# EAGLE design midiwall (EAGLE 6.6.0)
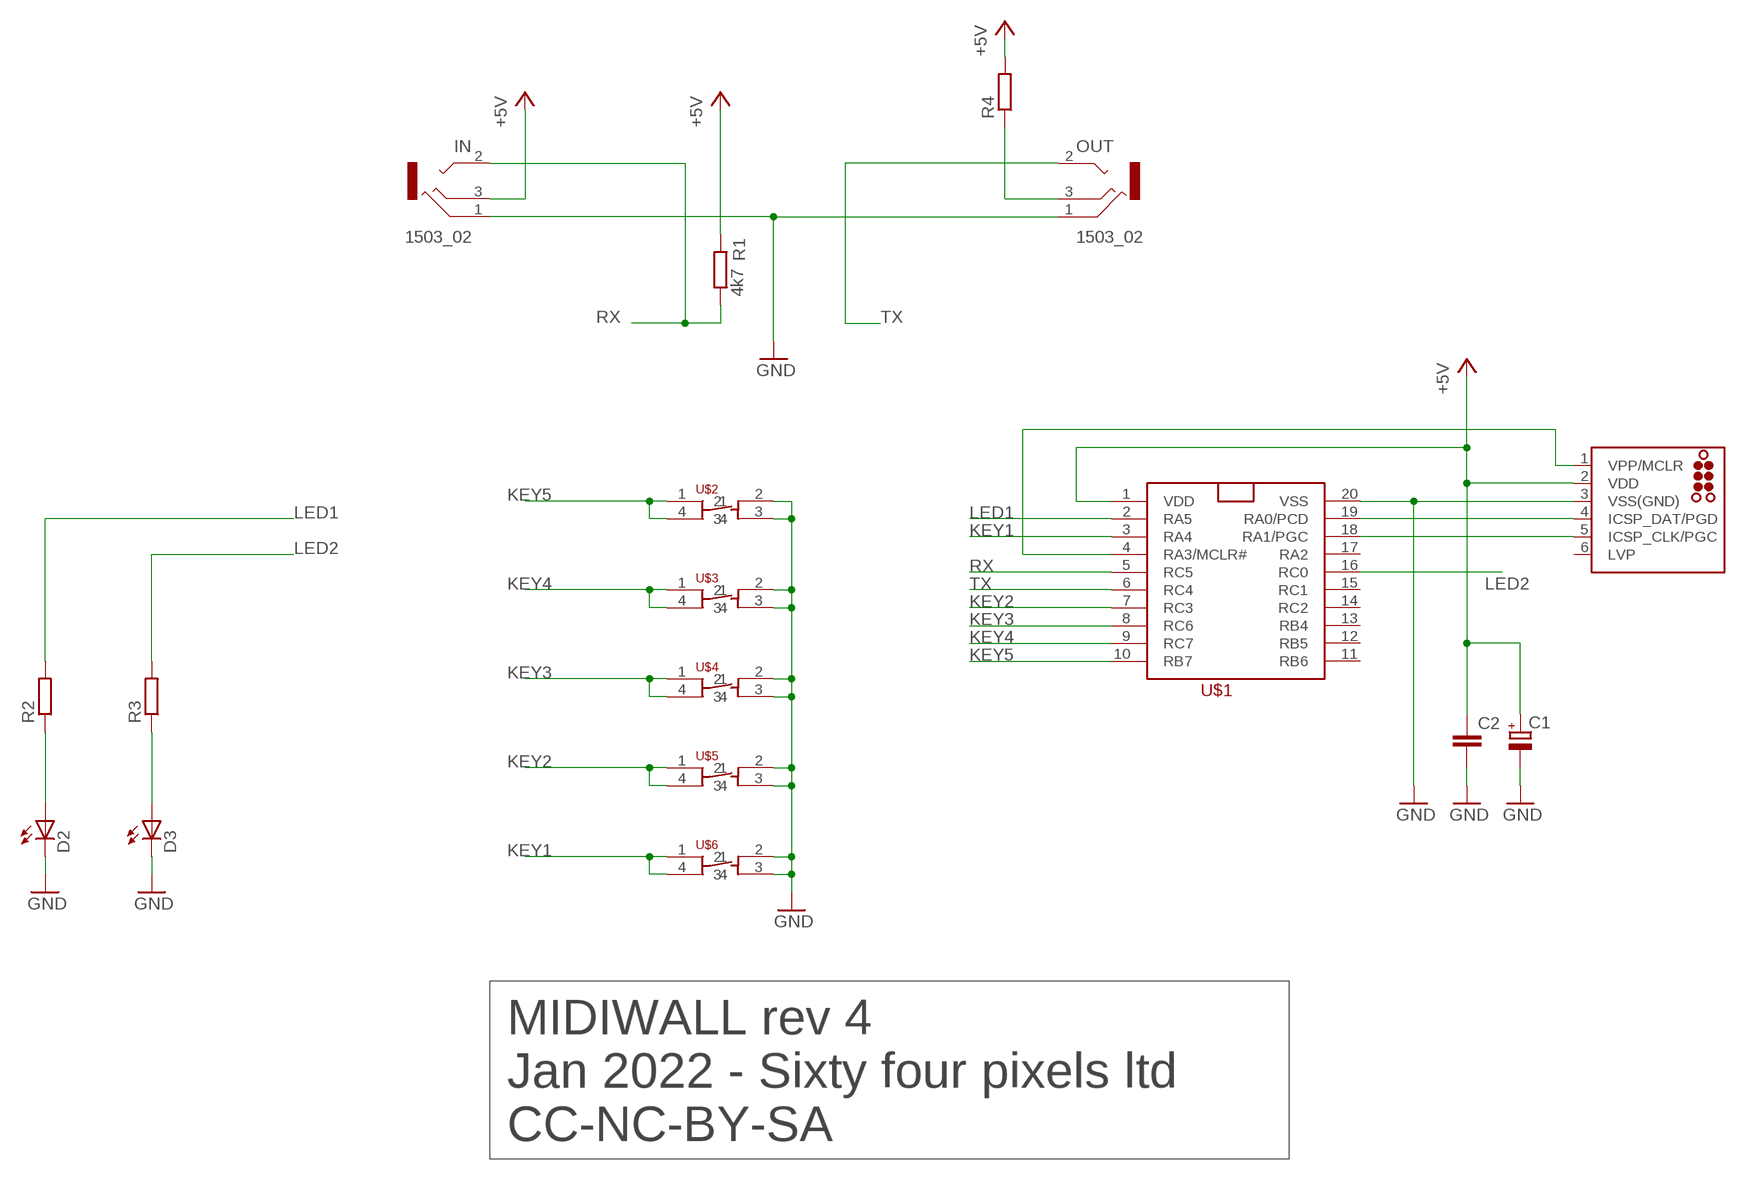
[diagram p0: schematic, sheet 1]

## Parts
C1  CPOL-EUSMCB  [SMC_B]
C2  C-EUC0805  [C0805]
D2  LEDCHIPLED_0805  [CHIPLED_0805]
D3  LEDCHIPLED_0805  [CHIPLED_0805]
ICSP  TC2030-MCP-NL  [TC2030-MCP-NL]
IN  1503_02  [1503_02]
OUT  1503_02  [1503_02]
R1  4k7  R-EU_R0805  [R0805]
R2  R-EU_R0805  [R0805]
R3  R-EU_R0805  [R0805]
R4  R-EU_R0805  [R0805]
U$1  PIC16F15345  [TSSOP20]
U$2  6MMTACTSMT  [6MMTACTSMT]
U$3  6MMTACTSMT  [6MMTACTSMT]
U$4  6MMTACTSMT  [6MMTACTSMT]
U$5  6MMTACTSMT  [6MMTACTSMT]
U$6  6MMTACTSMT  [6MMTACTSMT]

## Nets
+5V: C1.+ C2.1 ICSP.2(VDD) IN.3 R1.2 R4.2 U$1.1(VDD)
GND: C1.- C2.2 D2.C D3.C ICSP.3(VSS(GND)) IN.1 OUT.1 U$1.20(VSS) U$2.2 U$2.3 U$3.2 U$3.3 U$4.2 U$4.3 U$5.2 U$5.3 U$6.2 U$6.3
KEY1: U$1.3(RA4) U$6.1 U$6.4
KEY2: U$1.7(RC3) U$5.1 U$5.4
KEY3: U$1.8(RC6) U$4.1 U$4.4
KEY4: U$1.9(RC7) U$3.1 U$3.4
KEY5: U$1.10(RB7) U$2.1 U$2.4
LED1: R2.2 U$1.2(RA5)
LED2: R3.2 U$1.16(RC0)
N$1: D2.A R2.1
N$2: D3.A R3.1
N$3: OUT.3 R4.1
PGC: ICSP.5(ICSP_CLK/PGC) U$1.18(RA1/PGC)
PGD: ICSP.4(ICSP_DAT/PGD) U$1.19(RA0/PCD)
RX: IN.2 R1.1 U$1.5(RC5)
TX: OUT.2 U$1.6(RC4)
VPP: ICSP.1(VPP/MCLR) U$1.4(RA3/MCLR#)
Unconnected: ICSP.6(LVP) IN.2@2 OUT.2@2 U$1.11(RB6) U$1.12(RB5) U$1.13(RB4) U$1.14(RC2) U$1.15(RC1) U$1.17(RA2)

## Notes on the sheet
- MIDIWALL rev 4
- Jan 2022 - Sixty four pixels ltd
- CC-NC-BY-SA

## Library data of the parts
C1 = resistor:CPOL-EU: POLARIZED CAPACITOR, European symbol
C2 = rcl:C-EU: CAPACITOR, European symbol
D2 D3 = adafruit:LED: LED OSRAM: - CHIPLED LG R971, LG N971, LY N971, LG Q971, LY Q971, LO R971, LY R971 LH N974, LH R974 LS Q976, LO Q976, LY Q976 LO Q996 - Hyper CHIPLED LW Q18S LB Q993, LB Q99A, LB R99A - SideLED LS A670, LO A670, LY A670, LG A670, LP A670 LB A673, LV A673, LT A673, LW A673 LH A674 LY A675 LS A676, LA A676, LO A676, LY A676, LW A676 LS A679, LY A679, LG A679 - Hyper Micro SIDELED® LS Y876, LA Y876, LO Y876, LY Y876 LT Y87S - SmartLED LW L88C, LW L88S LB L89C, LB L89S, LG L890 LS L89K, LO L89K, LY L89K LS L896, LA L896, LO L896, LY L896 - TOPLED LS T670, LO T670, LY T670, LG T670, LP T670 LSG T670, LSP T670, LSY T670, LOP T670, LYG T670 LG T671, LOG T671, LSG T671 LB T673, LV T673, LT T673, LW T673 LH T674 LS T676, LA T676, LO T676, LY T676, LB T676, LH T676, LSB T676, LW T676 LB T67C, LV T67C, LT T67C, LS T67K, LO T67K, LY T67K, LW E67C LS E67B, LA E67B, LO E67B, LY E67B, LB E67C, LV E67C, LT E67C LW T67C LS T679, LY T679, LG T679 LS T770, LO T770, LY T770, LG T770, LP T770 LB T773, LV T773, LT T773, LW T773 LH T774 LS E675, LA E675, LY E675, LS T675 LS T776, LA T776, LO T776, LY T776, LB T776 LHGB T686 LT T68C, LB T68C - Hyper Mini TOPLED® LB M676 - Mini TOPLED Santana® LG M470 LS M47K, LO M47K, LY M47K Source: http://www.osram.convergy.de/
ICSP = tag-connect:TC2030: TAG-CONNECT ICSP Connector Manufacturer: Tag-Connect <http://www.tag-connect.com> Cable for easy In-Circuit Serial Programming. Designed for Microchip ICD2, suitable for many others. Two variants - one "with legs" (for hands-free fit on PCB) and another "without legs" for quick programming. PAD Description 1 MCLR/Vpp 2 Vdd 3 GND 4 PGD (ISPDAT) 5 PGC (ISPCLK) 6 nc (used for LVP) ©2009 ROFA.cz - modified and updated by Robert Darlington ‹rdarlington@gmail.com›
IN OUT = con-lumberg:1503_02: Jack connectors according to JISC 6560, 3.5 mm Klinkeneinbaukupplung nach JISC 6560, 3,5 mm, 3-polig/stereo, abgewinkelte Ausführung, Surface-Mount-Technik (SMT) Source: http://www.lumberg.com/Produkte/PDFs/1503_02.pdf; OC_FARNELL: 1216979; OC_NEWARK: unknown
R1-R4 = rcl:R-EU_: RESISTOR, European symbol
U$1 = jason_eagle6:PIC16F15345
U$2-U$6 = jason_eagle6:6MMTACTSMT

## Board
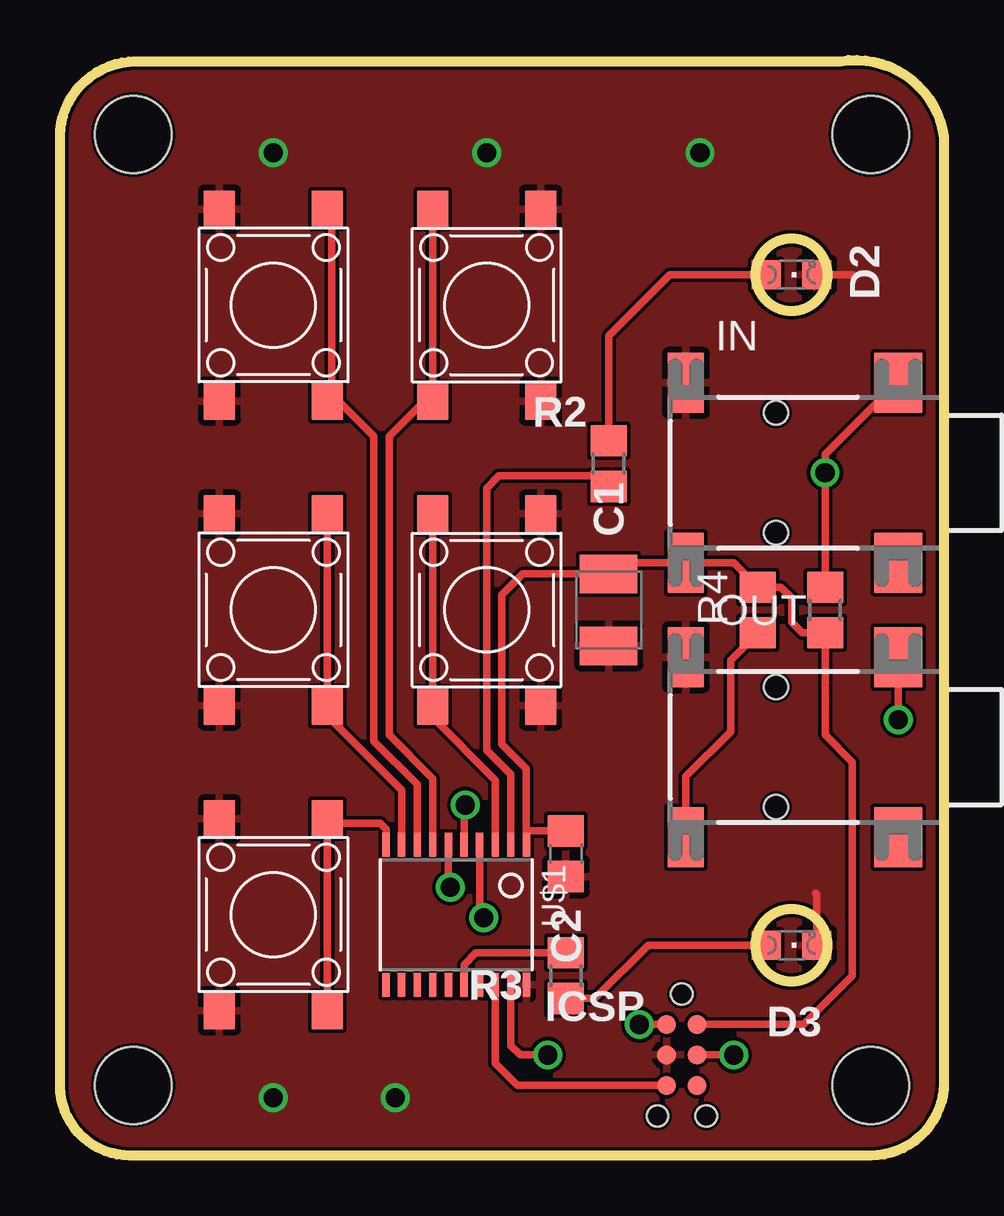
[diagram p1: board, top side]
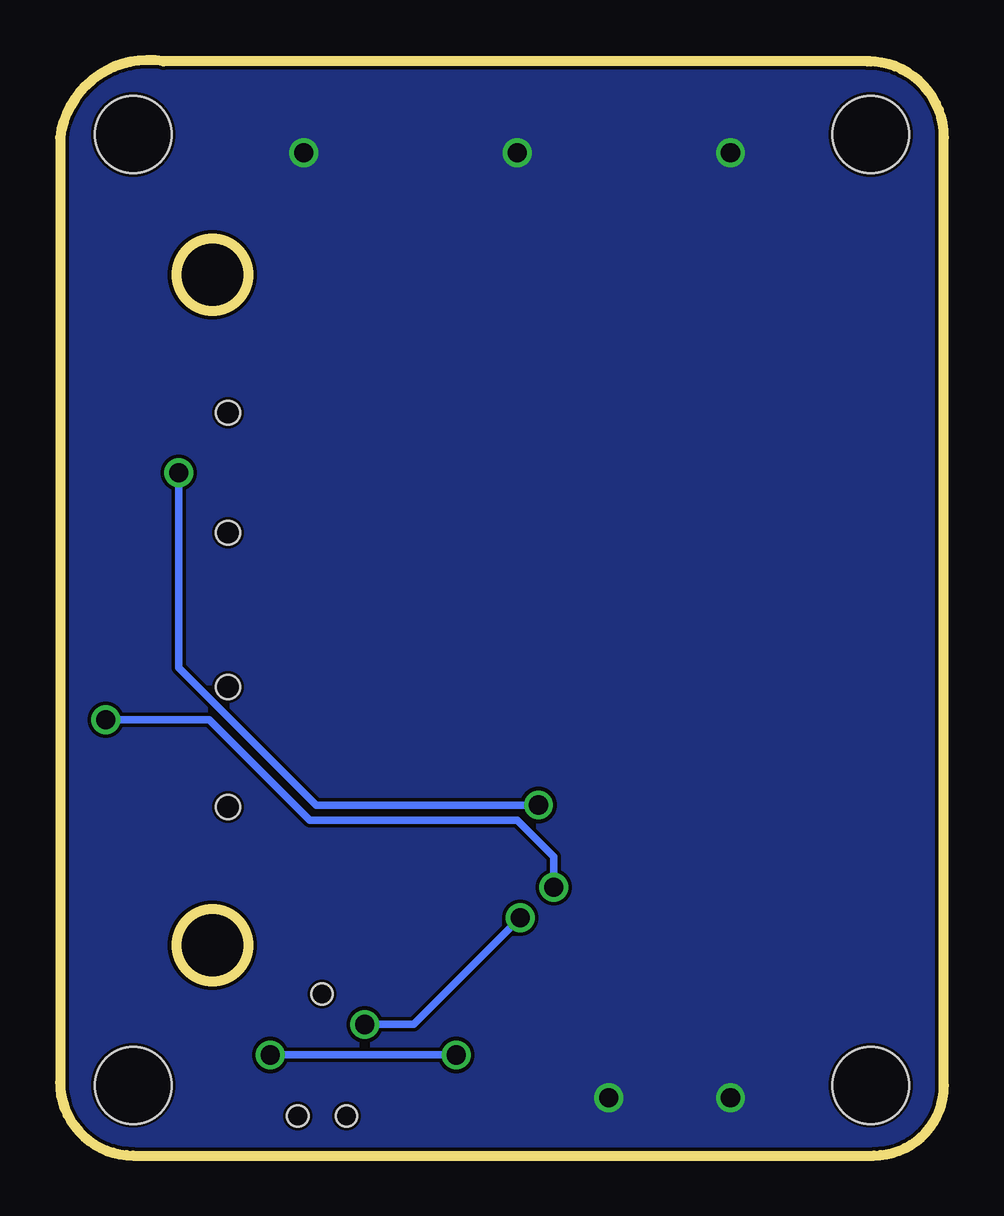
[diagram p2: board, bottom side, seen from below]

Size 36.83 x 45.65 mm. Coordinates in mm from the lower left corner, seen from the top.
Outline: 3.05,45.59 3.17,45.59
Outline: 3.17,45.59 32.51,45.59 arc-92 36.83,42.42 36.83,3.05 arc-90 33.78,0 2.92,0 arc-90 0,2.92 0,42.42 arc-90 3.17,45.59
Outline: circle at 30.48,36.7 radius 1.5
Outline: circle at 30.48,8.76 radius 1.5
Copper layers (1*16): Top 0.035mm / dielectric 1.5mm / Bottom 0.035mm
Design rules "hackvana": minimum track width 6mil, minimum drill 0.3mm, track to track 6mil, track to pad 9mil, pad to pad 6mil, via to via 6mil, smd to smd 0mil, copper to edge 6mil, drill to drill 6mil, minimum pad ring 10mil, minimum via ring 6mil, stop-mask expansion 2mil, vias tented up to drill 100mil, thermal gap 10mil
Holes 3.2 mm at 3.05,42.55 3.05,2.92 33.78,42.55 33.78,2.92

### Footprints (pad centres in the part's own frame; a part is rotated, then mirrored left to right if it is on the bottom)
SMC_B = smd 1.6 x 2.4: + -1.5,0; - 1.5,0
C0805 = smd 1.3 x 1.5: 1 -0.95,0; 2 0.95,0
CHIPLED_0805 = smd 1.2 x 1.2: A 0,-1.05; C 0,1.05
TC2030-MCP-NL = smd 0.787 x 0.787: 1 1.27,-0.635; 2 1.27,0.635; 3 2.54,-0.635; 4 2.54,0.635; 5 3.81,-0.635; 6 3.81,0.635 | hole 0.889: 0,0; 5.08,-1.016; 5.08,1.016
1503_02 = smd 2.5 x 1.5: 1 -3.75,-10.75; 3 3.75,-10.75 | smd 2.5 x 2: 2 -3.75,-1.9; 2@2 3.75,-1.9 | hole 1: -2.5,-7; 2.5,-7
R0805 = smd 1.3 x 1.5: 1 -0.95,0; 2 0.95,0
TSSOP20 = smd 0.305 x 0.991: 1 -2.925,-2.918; 2 -2.275,-2.918; 3 -1.625,-2.918; 4 -0.975,-2.918; 5 -0.325,-2.918; 6 0.325,-2.918; 7 0.975,-2.918; 8 1.625,-2.918; 9 2.275,-2.918; 10 2.925,-2.918; 11 2.925,2.918; 12 2.275,2.918; 13 1.625,2.918; 14 0.975,2.918; 15 0.325,2.918; 16 -0.325,2.918; 17 -0.975,2.918; 18 -1.625,2.918; 19 -2.275,2.918; 20 -2.925,2.918
6MMTACTSMT = smd 1.55 x 1.3: 1 -4,2.25; 2 -4,-2.25; 3 4,-2.25; 4 4,2.25

### Placement (x,y rotation side)
C1  22.86,22.73 270 top
C2  21.08,12.57 270 top
D2  30.48,36.7 270 top
D3  30.48,8.76 270 top
ICSP  25.91,6.73 270 top
IN  36.83,28.45 270 top
OUT  36.83,17.02 270 top
R1  31.88,22.73 270 top
R2  22.86,28.83 270 top
R3  21.08,7.49 90 top
R4  29.08,22.73 90 top
U$1  16.51,10.03 180 top
U$2  8.89,10.03 270 top
U$3  8.89,22.73 270 top
U$4  8.89,35.43 270 top
U$5  17.78,35.43 90 top
U$6  17.78,22.73 90 top

### Tracks (layer width: path | path; a pad name or v marks a point on that pad's centre or on a via)
+5V
  Top 0.305: C2.1 19.5,13.52 19.43,13.46 | U$1.1 19.43,13.46 | 19.43,13.46 19.43,16.12 18.41,17.14 18.41,23.37 19.28,24.23 C1.+ 23.32,24.7 IN.3 28.07,24.7 R4.2 30.04,23.68 30.48,23.24 30.48,22.23 30.92,21.78 R1.2 31.88,17.53 33.02,16.38 33.02,7.49 30.99,5.46 ICSP.2
GND  (via drill 0.8)
  Top 0.305: D2.C 33.02,36.7 | D3.C 31.53,10.89 31.5,10.92
  other vias: 8.89,41.78 17.78,41.78 26.67,41.78 8.89,2.41 13.97,2.41
  pour Top: -2.54,46.86 -2.54,-1.4 38.1,-1.4 38.1,48.13 -2.54,48.13
  pour Bottom: -3.81,46.86 -3.81,-5.21 41.91,-5.21 41.91,50.67 -3.81,50.67
KEY1
  Top 0.305: U$6.4 U$6.1 15.53,18.25 18.14,15.65 U$1.3
KEY2
  Top 0.305: U$1.7 15.54,15.71 13.72,17.53 13.72,29.97 15.24,31.5 15.24,31.62 15.34,31.62 U$5.1 U$5.4
KEY3
  Top 0.305: U$1.8 14.88,15.47 13.08,17.27 13.08,29.97 11.43,31.62 11.33,31.62 | U$4.1 11.33,39.24 11.33,31.62 | 11.33,31.62 U$4.4
KEY4
  Top 0.305: U$1.9 14.23,15.23 11.14,18.32 U$3.4 | U$3.4 11.24,18.73 11.43,18.92 | U$3.1 U$3.4
KEY5
  Top 0.305: U$1.10 13.59,13.59 13.34,13.84 11.33,13.84 U$2.1 U$2.4
LED1
  Top 0.305: U$1.2 18.79,15.89 17.78,16.89 17.78,27.81 18.29,28.32 22.73,28.32 22.86,28.19 R2.2
LED2
  Top 0.305: R3.2 17.33,8.44 16.84,7.94 U$1.16
N$1
  Top 0.305: D2.A 25.4,36.7 22.86,34.16 R2.1
N$2
  Top 0.305: D3.A 24.51,8.76 22.29,6.54 R3.1
N$3
  Top 0.305: OUT.3 26.08,15.79 27.94,17.65 27.94,20.64 R4.1
PGC
  Top 0.305: ICSP.5 19.05,2.92 18.14,3.84 U$1.18
PGD  (via drill 0.8)
  Top 0.305: U$1.19 18.79,4.58 19.18,4.19 v20.32,4.19 | v28.07,4.19 ICSP.4
  Bottom 0.305: v20.32,4.19 v28.07,4.19
RX  (via drill 0.8)
  Top 0.305: IN.2 34.35,31.62 34.29,31.62 31.88,29.21 v31.88,28.45 R1.1 | U$1.5 16.84,14.55 v16.89,14.6
  Bottom 0.305: v31.88,28.45 31.88,20.32 26.16,14.6 v16.89,14.6
TX  (via drill 0.8)
  Top 0.305: OUT.2 v34.93,18.17 v34.92,18.16 | U$1.6 16.18,11.25 v16.26,11.18
  Bottom 0.305: v16.26,11.18 16.26,12.45 17.78,13.97 26.42,13.97 30.61,18.16 v34.92,18.16
VPP  (via drill 0.8)
  Top 0.305: ICSP.1 v24.13,5.46 | U$1.4 17.48,10.07 v17.65,9.91
  Bottom 0.305: v24.13,5.46 22.1,5.46 v17.65,9.91